# Altium project LightLink_V3.PrjPcb (part 2 of 2)

## Sheet 12V_REG.SchDoc
size A4; SheetNumber: 5; SheetTotal: 9
Used 2 times, as channels 12V_REG_0, 12V_REG_1. Parts and nets are listed once, with the designators drawn on the sheet.
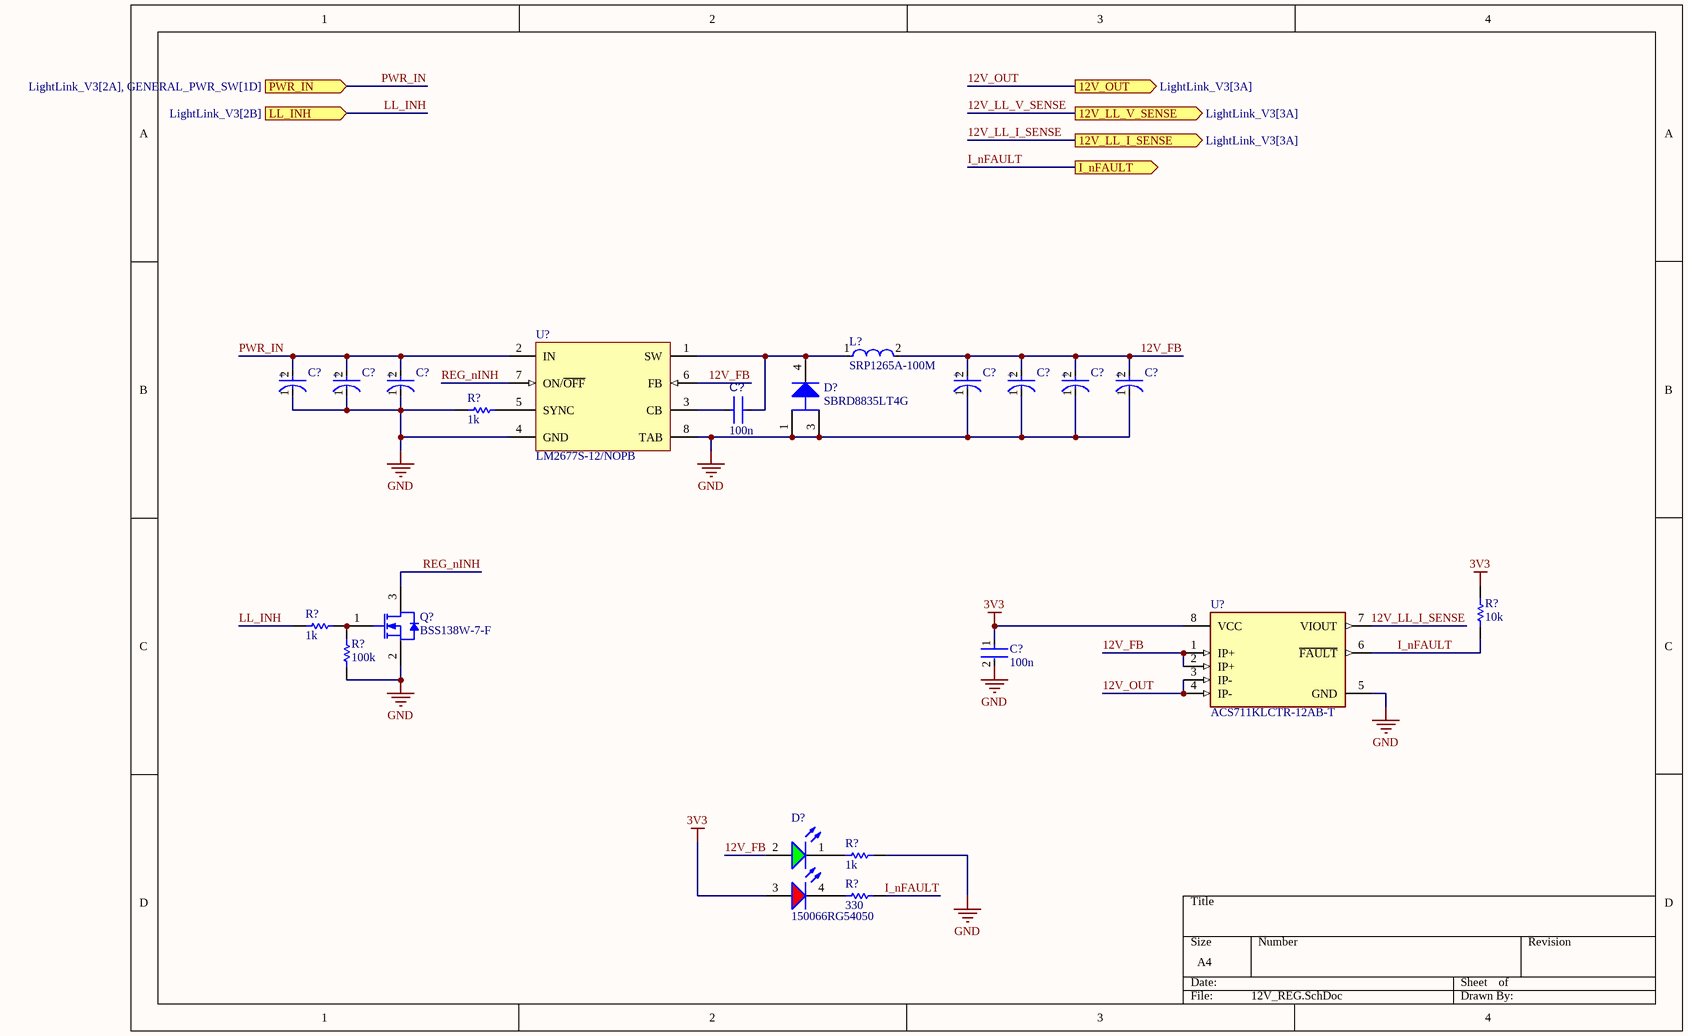
[diagram p7: 12V_REG.SchDoc]

### Parts
(Parts that share a designator on the sheet are numbered #1, #2 ... from top to bottom, then left to right.)
C?#1  TPSE686K025R0125  [FP-TPSE-MFG]  (value not drawn)
C?#2  TPSE686K025R0125  [FP-TPSE-MFG]  (value not drawn)
C?#3  TPSE686K025R0125  [FP-TPSE-MFG]  (value not drawn)
C?#4  T495D107K016ATE125  [FP-T495D107K016ATE125-MFG]  (value not drawn)
C?#5  T495D107K016ATE125  [FP-T495D107K016ATE125-MFG]  (value not drawn)
C?#6  T495D107K016ATE125  [FP-T495D107K016ATE125-MFG]  (value not drawn)
C?#7  T495D107K016ATE125  [FP-T495D107K016ATE125-MFG]  (value not drawn)
C?#8  100n  [C0402B]
C?#9  100n  [FP-0402-L_1_0_0_05-W_0_5-IPC_A]
D?#1  SBRD8835LT4G  [ONSC-DPAK-3-369C-01_V]
D?#2  150066RG54050  [WL-SBCD_0606]
L?  SRP1265A-100M  [FP-SRP1265A-100M-MFG]
Q?  BSS138W-7-F  [DIOD-SOT323-3_V]
R?#1  1k  [R0603B]
R?#2  10k  [R0603B]
R?#3  1k  [R0603B]
R?#4  100k  [R0603B]
R?#5  1k  [R0603B]
R?#6  330  [R0603B]
U?#1  LM2677S-12/NOPB  [KTW0007B_M]
U?#2  ACS711KLCTR-12AB-T  [FP-LC-8-IPC_C]

### Ports
12V_LL_I_SENSE (out, see LightLink_V3[3A]), 12V_LL_V_SENSE (out, see LightLink_V3[3A]), 12V_OUT (out, see LightLink_V3[3A]), I_nFAULT (out), LL_INH (in, see LightLink_V3[2B]), PWR_IN (in, see LightLink_V3[2A], GENERAL_PWR_SW[1D])

### Nets
3V3: C?#9.1 D?#2.3(A) R?#2.1 U?#2.8(VCC)
GND: C?#1.1(C) C?#2.1(C) C?#3.1(C) C?#4.1(C) C?#5.1(C) C?#6.1(C) C?#7.1(C) C?#9.2 D?#1.1(A) D?#1.3(A) Q?.2(S) R?#1.2 R?#4.2 R?#5.1 U?#1.4(GND) U?#1.8(TAB) U?#2.5(GND)
12V_FB: C?#4.2(A) C?#5.2(A) C?#6.2(A) C?#7.2(A) D?#2.2(A) L?.2 U?#1.6(FB) U?#2.1(IP+) U?#2.2(IP+)
12V_LL_I_SENSE: U?#2.7(VIOUT) ; port 12V_LL_I_SENSE
12V_LL_V_SENSE: port 12V_LL_V_SENSE
12V_OUT: U?#2.3(IP-) U?#2.4(IP-) ; port 12V_OUT
I_nFAULT: R?#2.2 R?#6.1 U?#2.6(~{FAULT}) ; port I_nFAULT
LL_INH: R?#3.2 ; port LL_INH
PWR_IN: C?#1.2(A) C?#2.2(A) C?#3.2(A) U?#1.2(IN) ; port PWR_IN
REG_nINH: Q?.3(D) U?#1.7(ON/~{OFF})
NetC?#8_1: C?#8.1 D?#1.4(K) L?.1 U?#1.1(SW)
NetC?#8_2: C?#8.2 U?#1.3(CB)
NetD?#2_1: D?#2.1(K) R?#5.2
NetD?#2_4: D?#2.4(K) R?#6.2
NetQ?_1: Q?.1(G) R?#3.1 R?#4.1
NetR?#1_1: R?#1.1 U?#1.5(SYNC)

### Channels
12V_REG_0: designators C?=C?_12V_REG_0#6 C?=C?_12V_REG_0#5 C?=C?_12V_REG_0#4 C?=C?_12V_REG_0#7 C?=C?_12V_REG_0#3 C?=C?_12V_REG_0#2 C?=C?_12V_REG_0#1 C?=C?_12V_REG_0#8 C?=C?_12V_REG_0#9 D?=D?_12V_REG_0#1 D?=D?_12V_REG_0#2 L?=L?_12V_REG_0 Q?=Q?_12V_REG_0 R?=R?_12V_REG_0#1 R?=R?_12V_REG_0#3 R?=R?_12V_REG_0#4 R?=R?_12V_REG_0#2 R?=R?_12V_REG_0#6 R?=R?_12V_REG_0#5 U?=U?_12V_REG_0#1 U?=U?_12V_REG_0#2; ports 12V_LL_I_SENSE=12V_LL_I_SENSE_12V_REG_0 12V_LL_V_SENSE=12V_LL_V_SENSE_12V_REG_0 12V_OUT=12V_OUT_12V_REG_0 I_nFAULT=I_nFAULT_12V_REG_0 LL_INH=LL_INH_12V_REG_0 PWR_IN=PWR_IN
12V_REG_1: designators C?=C?_12V_REG_1#6 C?=C?_12V_REG_1#5 C?=C?_12V_REG_1#4 C?=C?_12V_REG_1#7 C?=C?_12V_REG_1#3 C?=C?_12V_REG_1#2 C?=C?_12V_REG_1#1 C?=C?_12V_REG_1#8 C?=C?_12V_REG_1#9 D?=D?_12V_REG_1#1 D?=D?_12V_REG_1#2 L?=L?_12V_REG_1 Q?=Q?_12V_REG_1 R?=R?_12V_REG_1#1 R?=R?_12V_REG_1#3 R?=R?_12V_REG_1#4 R?=R?_12V_REG_1#2 R?=R?_12V_REG_1#6 R?=R?_12V_REG_1#5 U?=U?_12V_REG_1#1 U?=U?_12V_REG_1#2; ports 12V_LL_I_SENSE=12V_LL_I_SENSE_12V_REG_1 12V_LL_V_SENSE=12V_LL_V_SENSE_12V_REG_1 12V_OUT=12V_OUT_12V_REG_1 I_nFAULT=I_nFAULT_12V_REG_1 LL_INH=LL_INH_12V_REG_1 PWR_IN=PWR_IN

### Notes on the sheet
- (in symbol CMP-2000-07207-2) +
- (in symbol CMP-04424-000178-1) +

### Library data of the parts
C?#1-C?#3 = CMP-04424-000178-1: CAP TANT 68UF 10% 25V 2917; Leakage Current: 17uA; Dielectric Material: Tantalum; Dissipation Factor: 6%; Ripple Current: 460uA; Polarity: Polar; ESR (Equivalent Series Resistance): 125mR; Mount: Surface Mount; Voltage Rating: 25V; Min Operating Temperature: -55°C; Case Code (Imperial): 2917; RoHS Compliant: Yes; Depth: 4.3mm; Lead Free: Lead Free; Number of Pins: 2; Width: 4.3mm; Series: TPS; Radiation Hardening: No; Height - Seated (Max): 0.169inch; Capacitance: 68uF; Case Code (Metric): 7343; Length: 7.3mm; Max Operating Temperature: 125°C; Packaging: Tape and Reel; Case/Package: 2917; Package Quantity: 1; Features: General Purpose; Voltage: 25V; REACH SVHC: No SVHC; Tolerance: 10%; Voltage Rating (DC): 25V; Height: 4.1mm; Termination: SMD/SMT
C?#4-C?#7 = CMP-2000-07207-2: CAP TANT 100UF 10% 16V 2917; Life (Hours): 2000Hour; ESR (Equivalent Series Resistance): 125mR; Polarity: Polar; Dielectric Material: Tantalum; Dissipation Factor: 8%; Capacitance: 100uF; Radiation Hardening: No; RoHS Compliant: Yes; Length: 7.3mm; Features: General Purpose; Packaging: Tape and Reel; Package Quantity: 1; Weight: 0.023634oz; Voltage Rating: 16V; Width: 0.169inch; Case/Package: 2917; Mount: Surface Mount; Voltage: 16V; Min Operating Temperature: -55°C; Tolerance: 10%; REACH SVHC: No SVHC; Height - Seated (Max): 0.122inch; Number of Pins: 2; Construction: Flat; Depth: 4.3mm; Series: T495; Max Operating Temperature: 125°C; Failure Rate: 0.001%; Termination: SMD/SMT; Voltage Rating (DC): 16V; Case Code (Imperial): 2917; Case Code (Metric): 7343; Height: 2.8mm
C?#8 = CMP-001-00000-11: Non-polarized capacitor
C?#9 = CMP-001-00058-1: LARGE PADS, 0402 CAP, CHANGE COMMENT TO MATCH REAL P/N; Capacitor Type: Ceramic; Min Operating Temperature: -55°C; Mounting Technology: Surface Mount; Pins: 2; Case/Package: 0402; RoHS Compliant: Yes; Max Operating Temperature: 85°C
D?#1 = CMP-1055-00170-1: SWITCHMODE(TM) Power Rectifier, 3-Pin DPAK, Pb-Free, Tape and Reel; Manufacturer: On Semiconductor; Configuration: Single; IFSM Max (A): 75; PackageReference: DPAK-3-369C-01; PackageDescription: 3-Pin Flange Mount, Body 6.54 x 6.095 mm, Pitch 2.29 mm; ComponentLink3URL: http://www.onsemi.cn/pub_link/Collateral/369C.PDF; DatasheetVersion: Rev. 11; ComponentLink2URL: http://www.onsemi.cn/pub_link/Collateral/MBRD835L-D.PDF; Mounting Technology: Surface Mount; ComponentLink3Description: Package Specification; PackageVersion: Rev. E, 02/2014; ComponentLink1Description: Manufacturer URL; RoHS: TRUE; ComponentLink2Description: Datasheet; ComponentLink1URL: http://www.onsemi.com/; PartNumber: SBRD8835LT4G; Packing: Tape and Reel
D?#2 = CMP-004-00040-2: Led, Red/Grn, 180Mcd/230Mcd, 624Nm/525Nm Rohs Compliant: Yes; Source: rgled.SchLib; Component Type: Standard; Design Item ID: CMP-004-00034-2; Pins: 4
L? = CMP-07248-000069-1: FIXED IND 10UH 10A 16.5 MOHM SMD; Shielding: Shielded; Self Resonant Frequency: 10MHz; Test Frequency: 100kHz; Q Factor: 20; Saturation Current: 15.5A; Tolerance: 20%; Core Material: Carbonyl Powder; DC Resistance (DCR): 16.5mR; REACH SVHC: No SVHC; Case/Package: Nonstandard; Length: 13.5mm; RMS Current (Irms): 10A; Termination: SMD/SMT; Max DC Current: 10A; Ratings: AEC-Q200; Max Operating Temperature: 150°C; Height: 6.2mm; Resistor Type: Wirewound; Min Operating Temperature: -40°C; Mount: Surface Mount; Packaging: Cut Tape; Depth: 12.5mm; Package Quantity: 500; RoHS Compliant: Yes; Current Rating: 10A; Inductance Tolerance: 20%; Width: 0.492inch; Height - Seated (Max): 0.252inch; Inductance: 10uH
Q? = CMP-2000-05968-1: N-Channel Enhancement Mode Mosfet, 50 V, 200 mA, -55 to 150 degC, 6-Pin SOT-323, RoHS, Tape and Reel; Typical Turn-Off Delay Time: 20ns; Number of Channels: 1Channel; Type: EnhancementModeFieldEffectTransistor; Brand: DiodesIncorporated; Vds - Drain-Source Breakdown Voltage: 75V; Vgs - Gate-Source Voltage: 20V; Rds On - Drain-Source Resistance: 1.4Ohms; Transistor Type: 1N-Channel; Configuration: Single; Unit Weight: 0.000212oz; Pd - Power Dissipation: 200mW; Id - Continuous Drain Current: 200mA; Forward Transconductance - Min: 0.1S; Manufacturer URL: http://www.diodes.com/; Series: BSS138; Package Description: 3-Pin Small Outline Transistor, Body 2 x 1.25 mm, Pitch 0.65 mm; Mounting Technology: SurfaceMount; Product Category: MOSFET; RoHS: True; Maximum Operating Temperature: +150C; Height: 1mm; Length: 2.2mm; Technology: Si; Width: 1.35mm; Datasheet URL: http://www.diodes.com/_files/datasheets/ds30206.pdf; Manufacturer: DiodesIncorporated; Package / Case: SOT-323-3; Typical Turn-On Delay Time: 20ns; Transistor Polarity: N-Channel; Factory Pack Quantity: 3000; Packaging: Reel; Product: MOSFETSmallSignal; Datasheet Version: Rev. 11-2, 09/2013; Package Reference: SOT323; Minimum Operating Temperature: -55C; Mounting Style: SMD/SMT; Channel Mode: Enhancement
R?#1-R?#6 = CMP-009-00002-14: Resistor
  R?#1 R?#3 R?#5: Value: 1k
  R?#2: Value: 10k
  R?#4: Value: 100k
  R?#6: Value: 330
U?#1 = CMP-0069-00198-3: SIMPLE SWITCHER® High Efficiency 5A Step-Down Voltage Regulator with Sync, 7-pin TO-263, Pb-Free; Manufacturer: Texas Instruments; PowerWise: N; PackageTopMarking: NSUZXYTTE#*LM2677S*-12; ComponentLink1URL: http://www.ti.com/general/docs/lit/getliterature.tsp?genericPartNumber=LM2677&fileType=pdf; Code_JEDEC: MO-169-AC; CompType: Switcher; ComponentLink1Description: Datasheet URL; PackageDescription: TO-263, Molded, .400 x .390 x .180in Body, 7 Lead, .050in Pitch, Surface Mount; PackageReference: KTW0007B; RoHS: Y; PinCount: 7
U?#2 = CMP-1557-00012-2: SENSOR CURRENT HALL 12.5A AC/DC; Number of Channels: 1; Min Supply Voltage: 3V; Sensitivity: 110mV/A; Response Time: 4.6us; Operating Supply Voltage: 3.3V; Max Supply Voltage: 5.5V; Max Supply Current: 5.5mA; Bandwidth: 100kHz; Linearity: 1%; Quiescent Current: 4mA; Accuracy: 5%; Polarity: Bidirectional; Case/Package: SOIC; Packaging: Tape and Reel; Number of Pins: 8; Width: 3.9mm; Frequency: 100kHz; -3db Bandwidth: 100kHz; REACH SVHC: No SVHC; Series: -; Height: 1.5mm; Package Quantity: 1; Min Operating Temperature: -40°C; Max Operating Temperature: 125°C; Current Sensing: 12.5A; RoHS Compliant: Yes; Length: 4.9mm

## Sheet ADC088S022.SchDoc
size A4; SheetNumber: 8; SheetTotal: 9
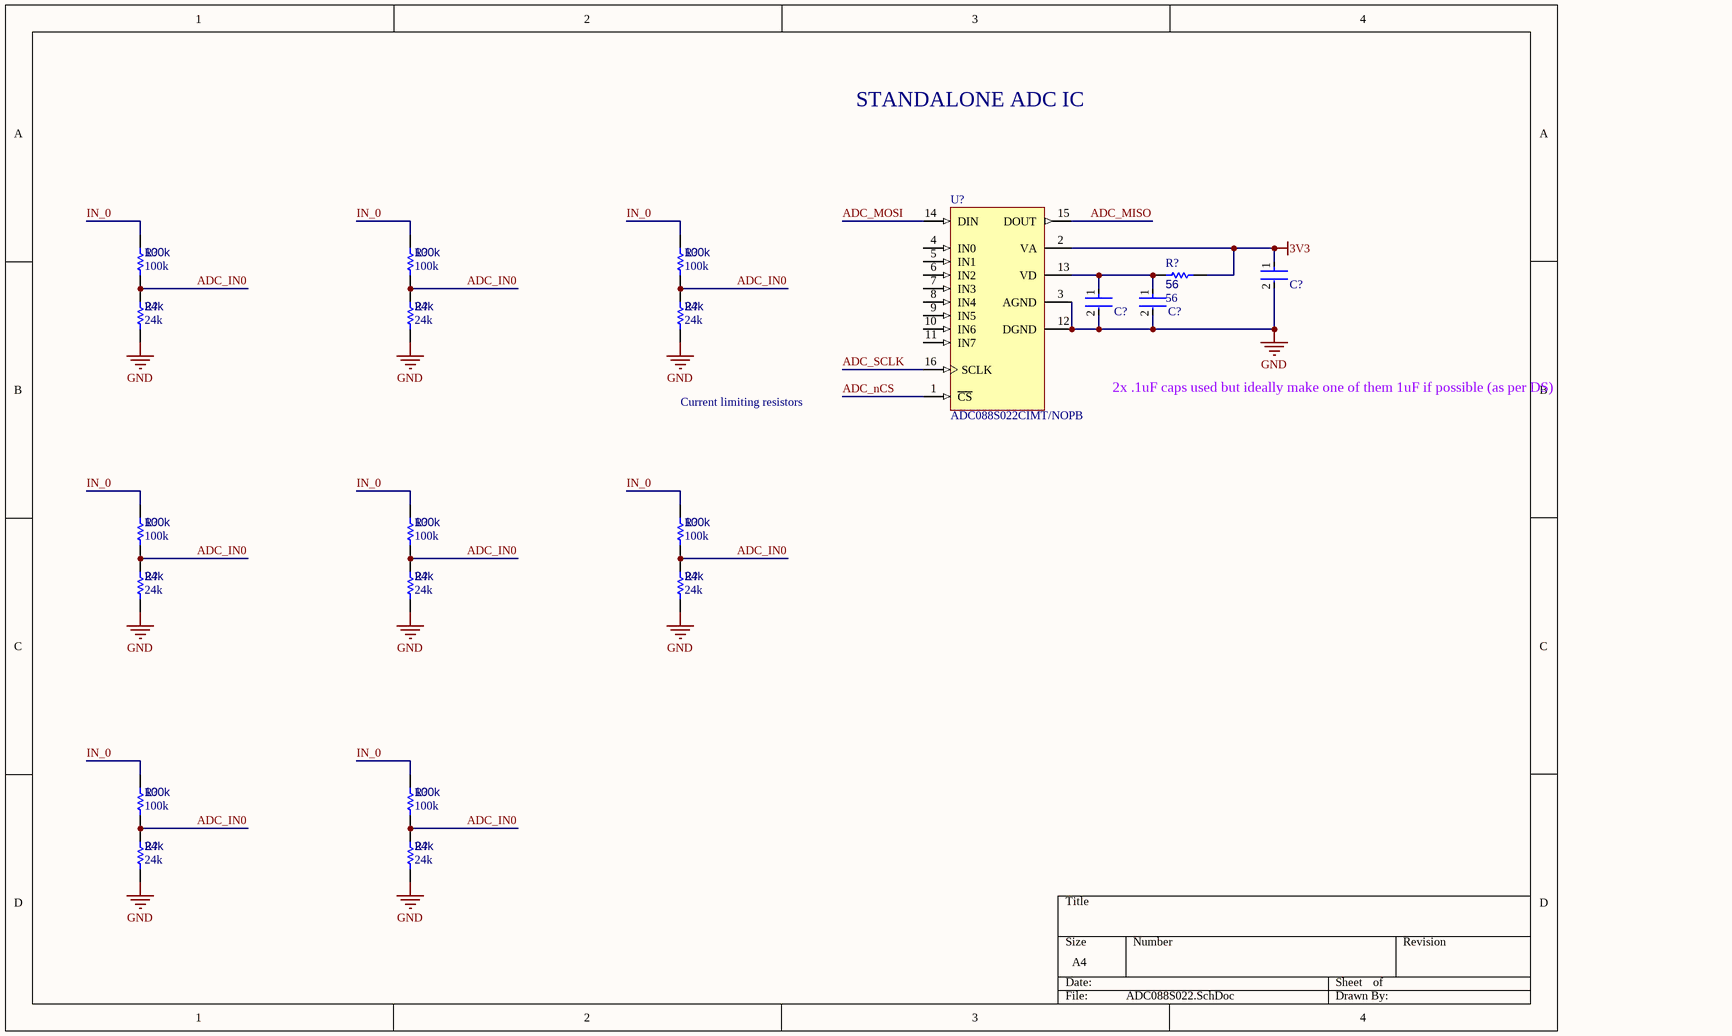
[diagram p8: ADC088S022.SchDoc]

### Parts
(Parts that share a designator on the sheet are numbered #1, #2 ... from top to bottom, then left to right.)
C?#32  C0402C104K8PACTU  [FP-C0402-BB-MFG]  (value not drawn)
C?#33  C0402C104K8PACTU  [FP-C0402-BB-MFG]  (value not drawn)
C?#34  C0402C104K8PACTU  [FP-C0402-BB-MFG]  (value not drawn)
R?#20  100k  [R0603B]
R?#21  100k  [R0603B]
R?#22  100k  [R0603B]
R?#23  56  [R0603B]
R?#24  24k  [R0603B]
R?#25  24k  [R0603B]
R?#26  24k  [R0603B]
R?#27  100k  [R0603B]
R?#28  100k  [R0603B]
R?#29  100k  [R0603B]
R?#30  24k  [R0603B]
R?#31  24k  [R0603B]
R?#32  24k  [R0603B]
R?#33  100k  [R0603B]
R?#34  100k  [R0603B]
R?#35  24k  [R0603B]
R?#36  24k  [R0603B]
U?#3  ADC088S022CIMT/NOPB  [MTC16_L]

### Nets
3V3: C?#32.1 R?#23.1 U?#3.2(VA)
GND: C?#32.2 C?#33.2 C?#34.2 R?#24.1 R?#25.1 R?#26.1 R?#30.1 R?#31.1 R?#32.1 R?#35.1 R?#36.1 U?#3.3(AGND) U?#3.12(DGND)
ADC_IN0: R?#20.1 R?#21.1 R?#22.1 R?#24.2 R?#25.2 R?#26.2 R?#27.1 R?#28.1 R?#29.1 R?#30.2 R?#31.2 R?#32.2 R?#33.1 R?#34.1 R?#35.2 R?#36.2
ADC_MISO: U?#3.15(DOUT)
ADC_MOSI: U?#3.14(DIN)
ADC_nCS: U?#3.1(~{CS})
ADC_SCLK: U?#3.16(SCLK)
IN_0: R?#20.2 R?#21.2 R?#22.2 R?#27.2 R?#28.2 R?#29.2 R?#33.2 R?#34.2
NetC?#33_1: C?#33.1 C?#34.1 R?#23.2 U?#3.13(VD)

Not connected (* = marked no-connect by the designer): U?#3 4(IN0) 5(IN1) 6(IN2) 7(IN3) 8(IN4) 9(IN5) 10(IN6) 11(IN7)

### Notes on the sheet
- STANDALONE ADC IC
- Current limiting resistors
- 2x .1uF caps used but ideally make one of them 1uF if possible (as per DS)

### Library data of the parts
C?#32-C?#34 = CMP-2008-02046-2: CAP CER 0.1UF 10V X5R 0402; Manufacturer: Kemet; Material: Ceramic; Capacitance: 0.10 μF; Temperature Coefficient: 15%; Tolerance: 0.1; Value: 0.10 μF; Package: C0402-BB; Temperature: -55°C to +125°C; ComponentLink2Description: Datasheet; Temperature Characteristic: X5R; Device Class L1: Passive Components; Height: 0.55mm; Lead Free: Yes; ComponentLink2URL: https://content.kemet.com/datasheets/KEM_C1002_X7R_SMD.pdf; Device Class L2: Capacitors; Temperature Range Low: -55°C; Temperature Range High: +125°C; RoHS: TRUE; Octopart: https://octopart.com/c0402c104k8pactu-kemet-140039; Automotive: No; Mouser Description: Capacitor 100 nF 10 VDC 0402; Category: Cap; Voltage Rating: 10 V; Digikey Description: CAP CER 0.1UF 10V X5R 0402; Ipc Land Pattern Name: CAPC10050X50; Device Class L3: Ceramic Capacitors; Manufacturer Part Number: C0402C104K8PACTU
R?#20-R?#36 = CMP-009-00002-14: Resistor
  R?#20-R?#22 R?#27-R?#29 R?#33 R?#34: Value: 100k
  R?#23: Value: 56
  R?#24-R?#26 R?#30-R?#32 R?#35 R?#36: Value: 24k
U?#3 = CMP-0054-00372-2: 8-Channel, 50 kSPS to 200 kSPS, 8-Bit A/D Converter, 16-pin TSSOP, Pb-Free; Manufacturer: National Semiconductor; PackageTopMarking: NSUZXYTT*88S022*CIMT; CompType: ADC IC; PowerWise: Y; ComponentLink2URL: http://www.national.com/pf/AD/ADC088S022.html; RoHS: Y; PackageDescription: Molded TSSOP, Jedec, 5 x 4.4 x 0.9mm Body, 16 Lead, 0.65mm Pitch; DatasheetVersion: Feb-2010; PinCount: 16; ComponentLink1Description: ADC088S022 Datasheet; Code_JEDEC: MO-153-AB; ComponentLink3URL: http://www.national.com/packaging/folders/mtc16.html; PackageVersion: revD, Jun-2003; ComponentLink3Description: MTC16 Package Page; RevisionNote: Component URLs added; ComponentLink1URL: http://www.national.com/ds/AD/ADC088S022.pdf; ComponentLink2Description: ADC088S022 Web Page; PackageReference: MTC16

## Sheet BYPASS_BLOCK.SchDoc
size A4; SheetNumber: 6; SheetTotal: 7
Used 4 times, as channels BYPASS_0, BYPASS_1, BYPASS_2, BYPASS_3. Parts and nets are listed once, with the designators drawn on the sheet.
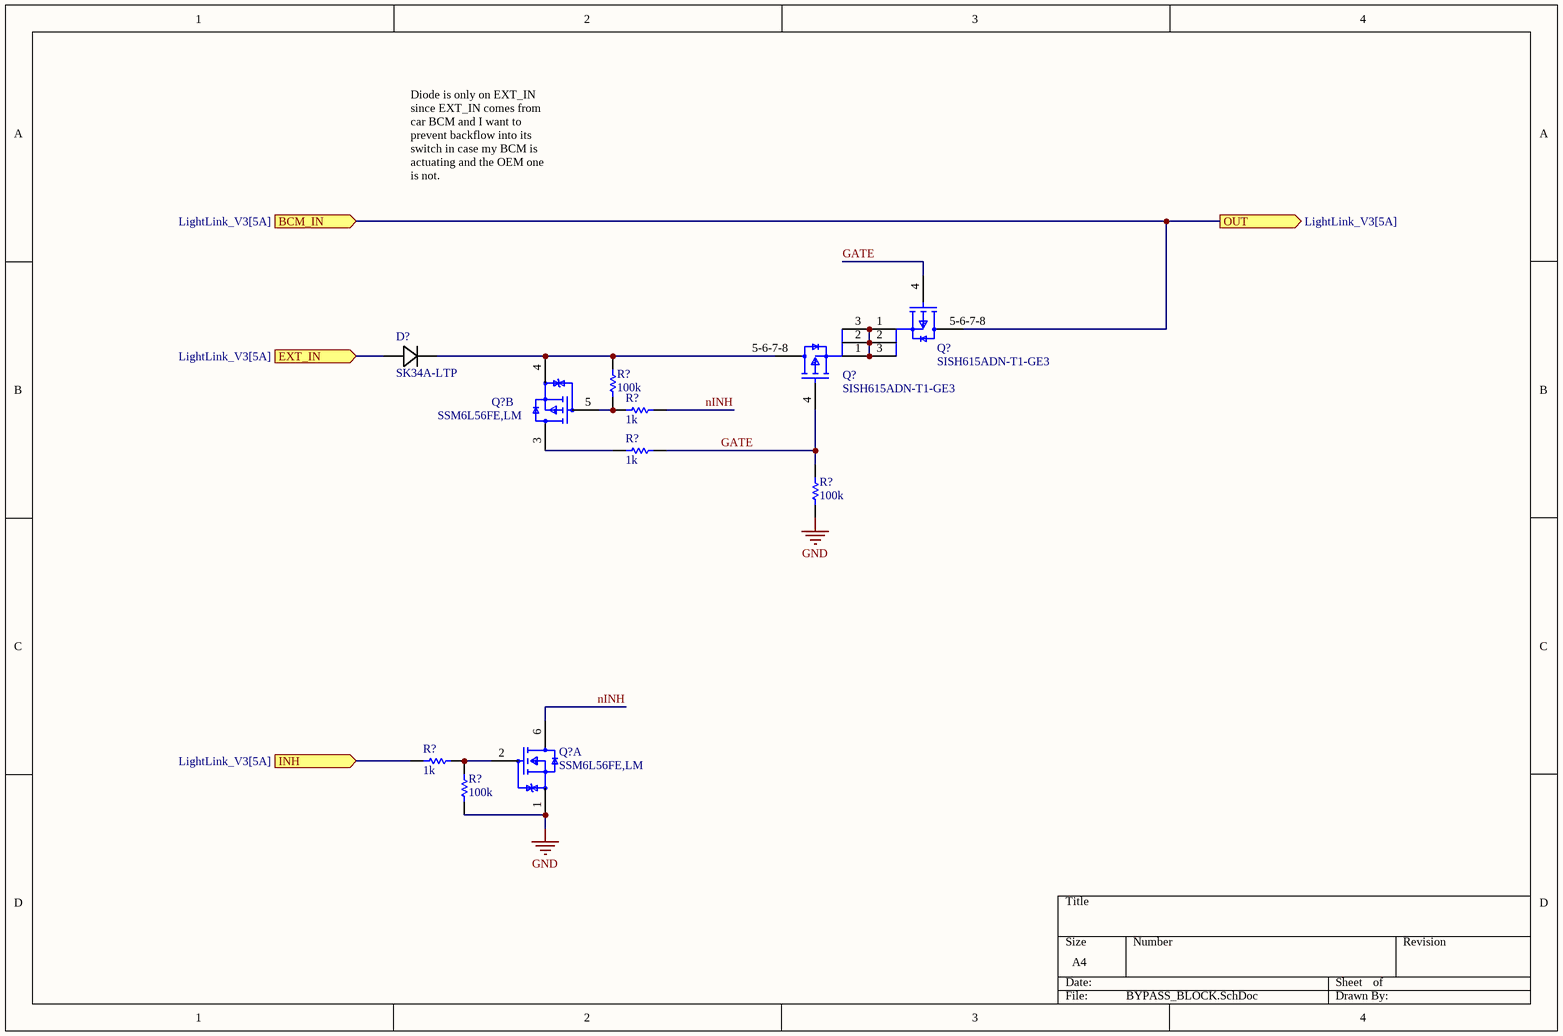
[diagram p9: BYPASS_BLOCK.SchDoc]

### Parts
(Parts that share a designator on the sheet are numbered #1, #2 ... from top to bottom, then left to right.)
D?  SK34A-LTP  [SK34A-LTP-Footprint-1]
Q?#1  SISH615ADN-T1-GE3  [SISH615ADN-T1-GE3-Footprint-1]
Q?#2  SSM6L56FE,LM  [FP-SON6-P-0_50-MFG]  (part B of 2)
Q?#3  SISH615ADN-T1-GE3  [SISH615ADN-T1-GE3-Footprint-1]
Q?#4  SSM6L56FE,LM  [FP-SON6-P-0_50-MFG]  (part A of 2)
R?#1  100k  [R0603B]
R?#2  1k  [R0603B]
R?#3  1k  [R0603B]
R?#4  100k  [R0603B]
R?#5  1k  [R0603B]
R?#6  100k  [R0603B]

### Ports
BCM_IN (in, see LightLink_V3[5A]), EXT_IN (in, see LightLink_V3[5A]), INH (in, see LightLink_V3[5A]), OUT (out, see LightLink_V3[5A])

### Nets
GND: Q?#4.1(Source_1) R?#4.2 R?#6.1
BCM_IN: Q?#1.5-6-7-8(D) ; port OUT, port BCM_IN
EXT_IN: D?.2(ANODE) ; port EXT_IN
GATE: Q?#1.4(G) Q?#3.4(G) R?#3.2 R?#4.1
INH: R?#5.2 ; port INH
nINH: Q?#4.6(Drain_1) R?#2.2
NetD?_1: D?.1(CATHODE) Q?#2.4(Source_2) Q?#3.5-6-7-8(D) R?#1.1
NetQ?#1_1: Q?#1.1(S) Q?#1.2(S) Q?#1.3(S) Q?#3.1(S) Q?#3.2(S) Q?#3.3(S)
NetQ?#2_3: Q?#2.3(Drain_2) R?#3.1
NetQ?#2_5: Q?#2.5(Gate_2) R?#1.2 R?#2.1
NetQ?#4_2: Q?#4.2(Gate_1) R?#5.1 R?#6.2

### Channels
BYPASS_0: designators D?=D?_BYPASS_0 Q?=Q?_BYPASS_0#3 Q?=Q?_BYPASS_0#1 Q?=Q?_BYPASS_0#4 Q?=Q?_BYPASS_0#2 R?=R?_BYPASS_0#4 R?=R?_BYPASS_0#1 R?=R?_BYPASS_0#2 R?=R?_BYPASS_0#6 R?=R?_BYPASS_0#5 R?=R?_BYPASS_0#3; ports BCM_IN=M1_OUT EXT_IN=EXT_IN_0 INH=INH_EXT_0 OUT=M1_OUT
BYPASS_1: designators D?=D?_BYPASS_1 Q?=Q?_BYPASS_1#3 Q?=Q?_BYPASS_1#1 Q?=Q?_BYPASS_1#4 Q?=Q?_BYPASS_1#2 R?=R?_BYPASS_1#4 R?=R?_BYPASS_1#1 R?=R?_BYPASS_1#2 R?=R?_BYPASS_1#6 R?=R?_BYPASS_1#5 R?=R?_BYPASS_1#3; ports BCM_IN=M2_OUT EXT_IN=EXT_IN_1 INH=INH_EXT_1 OUT=M2_OUT
BYPASS_2: designators D?=D?_BYPASS_2 Q?=Q?_BYPASS_2#3 Q?=Q?_BYPASS_2#1 Q?=Q?_BYPASS_2#4 Q?=Q?_BYPASS_2#2 R?=R?_BYPASS_2#4 R?=R?_BYPASS_2#1 R?=R?_BYPASS_2#2 R?=R?_BYPASS_2#6 R?=R?_BYPASS_2#5 R?=R?_BYPASS_2#3; ports BCM_IN=M3_OUT EXT_IN=EXT_IN_2 INH=INH_EXT_2 OUT=M3_OUT
BYPASS_3: designators D?=D?_BYPASS_3 Q?=Q?_BYPASS_3#3 Q?=Q?_BYPASS_3#1 Q?=Q?_BYPASS_3#4 Q?=Q?_BYPASS_3#2 R?=R?_BYPASS_3#4 R?=R?_BYPASS_3#1 R?=R?_BYPASS_3#2 R?=R?_BYPASS_3#6 R?=R?_BYPASS_3#5 R?=R?_BYPASS_3#3; ports BCM_IN=M4_OUT EXT_IN=EXT_IN_3 INH=INH_EXT_3 OUT=M4_OUT

### Notes on the sheet
- Diode is only on EXT_IN since EXT_IN comes from car BCM and I want to prevent backflow into its switch in case my BCM is actuating and the OEM one is not.

### Library data of the parts
D? = CMP-004-00058-2: Rectifier Diode, Schottky, 1 Phase, 1 Element, 3A, 40V V(RRM), Silicon, DO-214AC; Forward Voltage: 500mV; Max Operating Temperature: 125°C; Pins: 2; RoHS Compliant: Yes
Q?#1 Q?#3 = CMP-013-00018-2: Trans MOSFET P-CH 20V 22.1A 8-Pin PowerPAK 1212 EP T/R; Source: SISH615ADN-T1-GE3.SchLib; Design Item ID: CMP-013-00036-4; Component Type: Standard; Pins: 5
Q?#2 Q?#4 = CMP-35916-000023-1: SMALL-SIGNAL MOSFET 2 IN 1 NCH +
R?#1-R?#6 = CMP-009-00002-14: Resistor
  R?#1 R?#4 R?#6: Value: 100k
  R?#2 R?#3 R?#5: Value: 1k

## Nets that join several sheets
3V3: STM32H730_PINOUT (24 pins), TCAN1146_PWR_MGMT (C?#25.2 U?#1.5), MOSFET_BANK_0 (14 pins), MOSFET_BANK_1 (14 pins), MOSFET_BANK_2 (14 pins), 12V_REG_0 (C?_12V_REG_0#9.1 D?_12V_REG_0#2.3 R?_12V_REG_0#2.1 U?_12V_REG_0#2.8), 12V_REG_1 (C?_12V_REG_1#9.1 D?_12V_REG_1#2.3 R?_12V_REG_1#2.1 U?_12V_REG_1#2.8), ADC088S022 (C?#32.1 R?#23.1 U?#3.2), MOSFET_BANK_3 (14 pins)
GND: STM32H730_PINOUT (34 pins), TCAN1146_PWR_MGMT (18 pins), MOSFET_BANK_0 (18 pins), MOSFET_BANK_1 (18 pins), MOSFET_BANK_2 (18 pins), 12V_REG_0 (17 pins), 12V_REG_1 (17 pins), ADC088S022 (13 pins), BYPASS_0 (Q?_BYPASS_0#4.1 R?_BYPASS_0#4.2 R?_BYPASS_0#6.1), MOSFET_BANK_3 (18 pins), BYPASS_1 (Q?_BYPASS_1#4.1 R?_BYPASS_1#4.2 R?_BYPASS_1#6.1), BYPASS_2 (Q?_BYPASS_2#4.1 R?_BYPASS_2#4.2 R?_BYPASS_2#6.1), BYPASS_3 (Q?_BYPASS_3#4.1 R?_BYPASS_3#4.2 R?_BYPASS_3#6.1)
PWR_IN: LightLink_V3 (6 pins), TCAN1146_PWR_MGMT (F1.1)
PWR_IN: TCAN1146_PWR_MGMT (5 pins), MOSFET_BANK_0 (8 pins), MOSFET_BANK_1 (8 pins), MOSFET_BANK_2 (8 pins), 12V_REG_0 (C?_12V_REG_0#1.2 C?_12V_REG_0#2.2 C?_12V_REG_0#3.2 U?_12V_REG_0#1.2), 12V_REG_1 (C?_12V_REG_1#1.2 C?_12V_REG_1#2.2 C?_12V_REG_1#3.2 U?_12V_REG_1#1.2), MOSFET_BANK_3 (8 pins)
ADC_MISO: MOSFET_BANK_0 (U9_MOSFET_BANK_0.15), MOSFET_BANK_1 (U9_MOSFET_BANK_1.15), MOSFET_BANK_2 (U9_MOSFET_BANK_2.15), MOSFET_BANK_3 (U9_MOSFET_BANK_3.15)
ADC_MOSI: MOSFET_BANK_0 (U9_MOSFET_BANK_0.14), MOSFET_BANK_1 (U9_MOSFET_BANK_1.14), MOSFET_BANK_2 (U9_MOSFET_BANK_2.14), MOSFET_BANK_3 (U9_MOSFET_BANK_3.14)
ADC_SCLK: MOSFET_BANK_0 (U9_MOSFET_BANK_0.16), MOSFET_BANK_1 (U9_MOSFET_BANK_1.16), MOSFET_BANK_2 (U9_MOSFET_BANK_2.16), MOSFET_BANK_3 (U9_MOSFET_BANK_3.16)
CAN_N: LightLink_V3 (J?#4.35), TCAN1146_PWR_MGMT (5 pins)
CAN_P: LightLink_V3 (J?#4.34), TCAN1146_PWR_MGMT (5 pins)
EXT_IN_0: LightLink_V3 (J?#4.20), BYPASS_0 (D?_BYPASS_0.2)
EXT_IN_1: LightLink_V3 (J?#4.21), BYPASS_1 (D?_BYPASS_1.2)
EXT_IN_2: LightLink_V3 (J?#4.31), BYPASS_2 (D?_BYPASS_2.2)
EXT_IN_3: LightLink_V3 (J?#4.32), BYPASS_3 (D?_BYPASS_3.2)
M1_OUT: LightLink_V3 (J?#3.1), MOSFET_BANK_0 (U?_MOSFET_BANK_0#1.3 U?_MOSFET_BANK_0#1.4), BYPASS_0 (Q?_BYPASS_0#1.5-6-7-8)
M1_OUT: LightLink_V3 (J?#3.5), MOSFET_BANK_1 (U?_MOSFET_BANK_1#1.3 U?_MOSFET_BANK_1#1.4)
M1_OUT: LightLink_V3 (J?#3.15), MOSFET_BANK_2 (U?_MOSFET_BANK_2#1.3 U?_MOSFET_BANK_2#1.4)
M1_OUT: LightLink_V3 (J?#4.25), MOSFET_BANK_3 (U?_MOSFET_BANK_3#1.3 U?_MOSFET_BANK_3#1.4)
M2_OUT: LightLink_V3 (J?#3.2), MOSFET_BANK_0 (U?_MOSFET_BANK_0#2.3 U?_MOSFET_BANK_0#2.4), BYPASS_1 (Q?_BYPASS_1#1.5-6-7-8)
M2_OUT: LightLink_V3 (J?#3.6), MOSFET_BANK_1 (U?_MOSFET_BANK_1#2.3 U?_MOSFET_BANK_1#2.4)
M2_OUT: LightLink_V3 (J?#3.16), MOSFET_BANK_2 (U?_MOSFET_BANK_2#2.3 U?_MOSFET_BANK_2#2.4)
M2_OUT: LightLink_V3 (J?#4.26), MOSFET_BANK_3 (U?_MOSFET_BANK_3#2.3 U?_MOSFET_BANK_3#2.4)
M3_OUT: LightLink_V3 (J?#3.3), MOSFET_BANK_0 (U?_MOSFET_BANK_0#3.3 U?_MOSFET_BANK_0#3.4), BYPASS_2 (Q?_BYPASS_2#1.5-6-7-8)
M3_OUT: LightLink_V3 (J?#3.13), MOSFET_BANK_1 (U?_MOSFET_BANK_1#3.3 U?_MOSFET_BANK_1#3.4)
M3_OUT: LightLink_V3 (J?#3.17), MOSFET_BANK_2 (U?_MOSFET_BANK_2#3.3 U?_MOSFET_BANK_2#3.4)
M3_OUT: LightLink_V3 (J?#4.27), MOSFET_BANK_3 (U?_MOSFET_BANK_3#3.3 U?_MOSFET_BANK_3#3.4)
M4_OUT: LightLink_V3 (J?#3.4), MOSFET_BANK_0 (U?_MOSFET_BANK_0#4.3 U?_MOSFET_BANK_0#4.4), BYPASS_3 (Q?_BYPASS_3#1.5-6-7-8)
M4_OUT: LightLink_V3 (J?#3.14), MOSFET_BANK_1 (U?_MOSFET_BANK_1#4.3 U?_MOSFET_BANK_1#4.4)
M4_OUT: LightLink_V3 (J?#4.24), MOSFET_BANK_2 (U?_MOSFET_BANK_2#4.3 U?_MOSFET_BANK_2#4.4)
M4_OUT: LightLink_V3 (J?#4.28), MOSFET_BANK_3 (U?_MOSFET_BANK_3#4.3 U?_MOSFET_BANK_3#4.4)